# EAGLE design Adafruit_PN532_Shield_v1.3 (EAGLE 6.3)
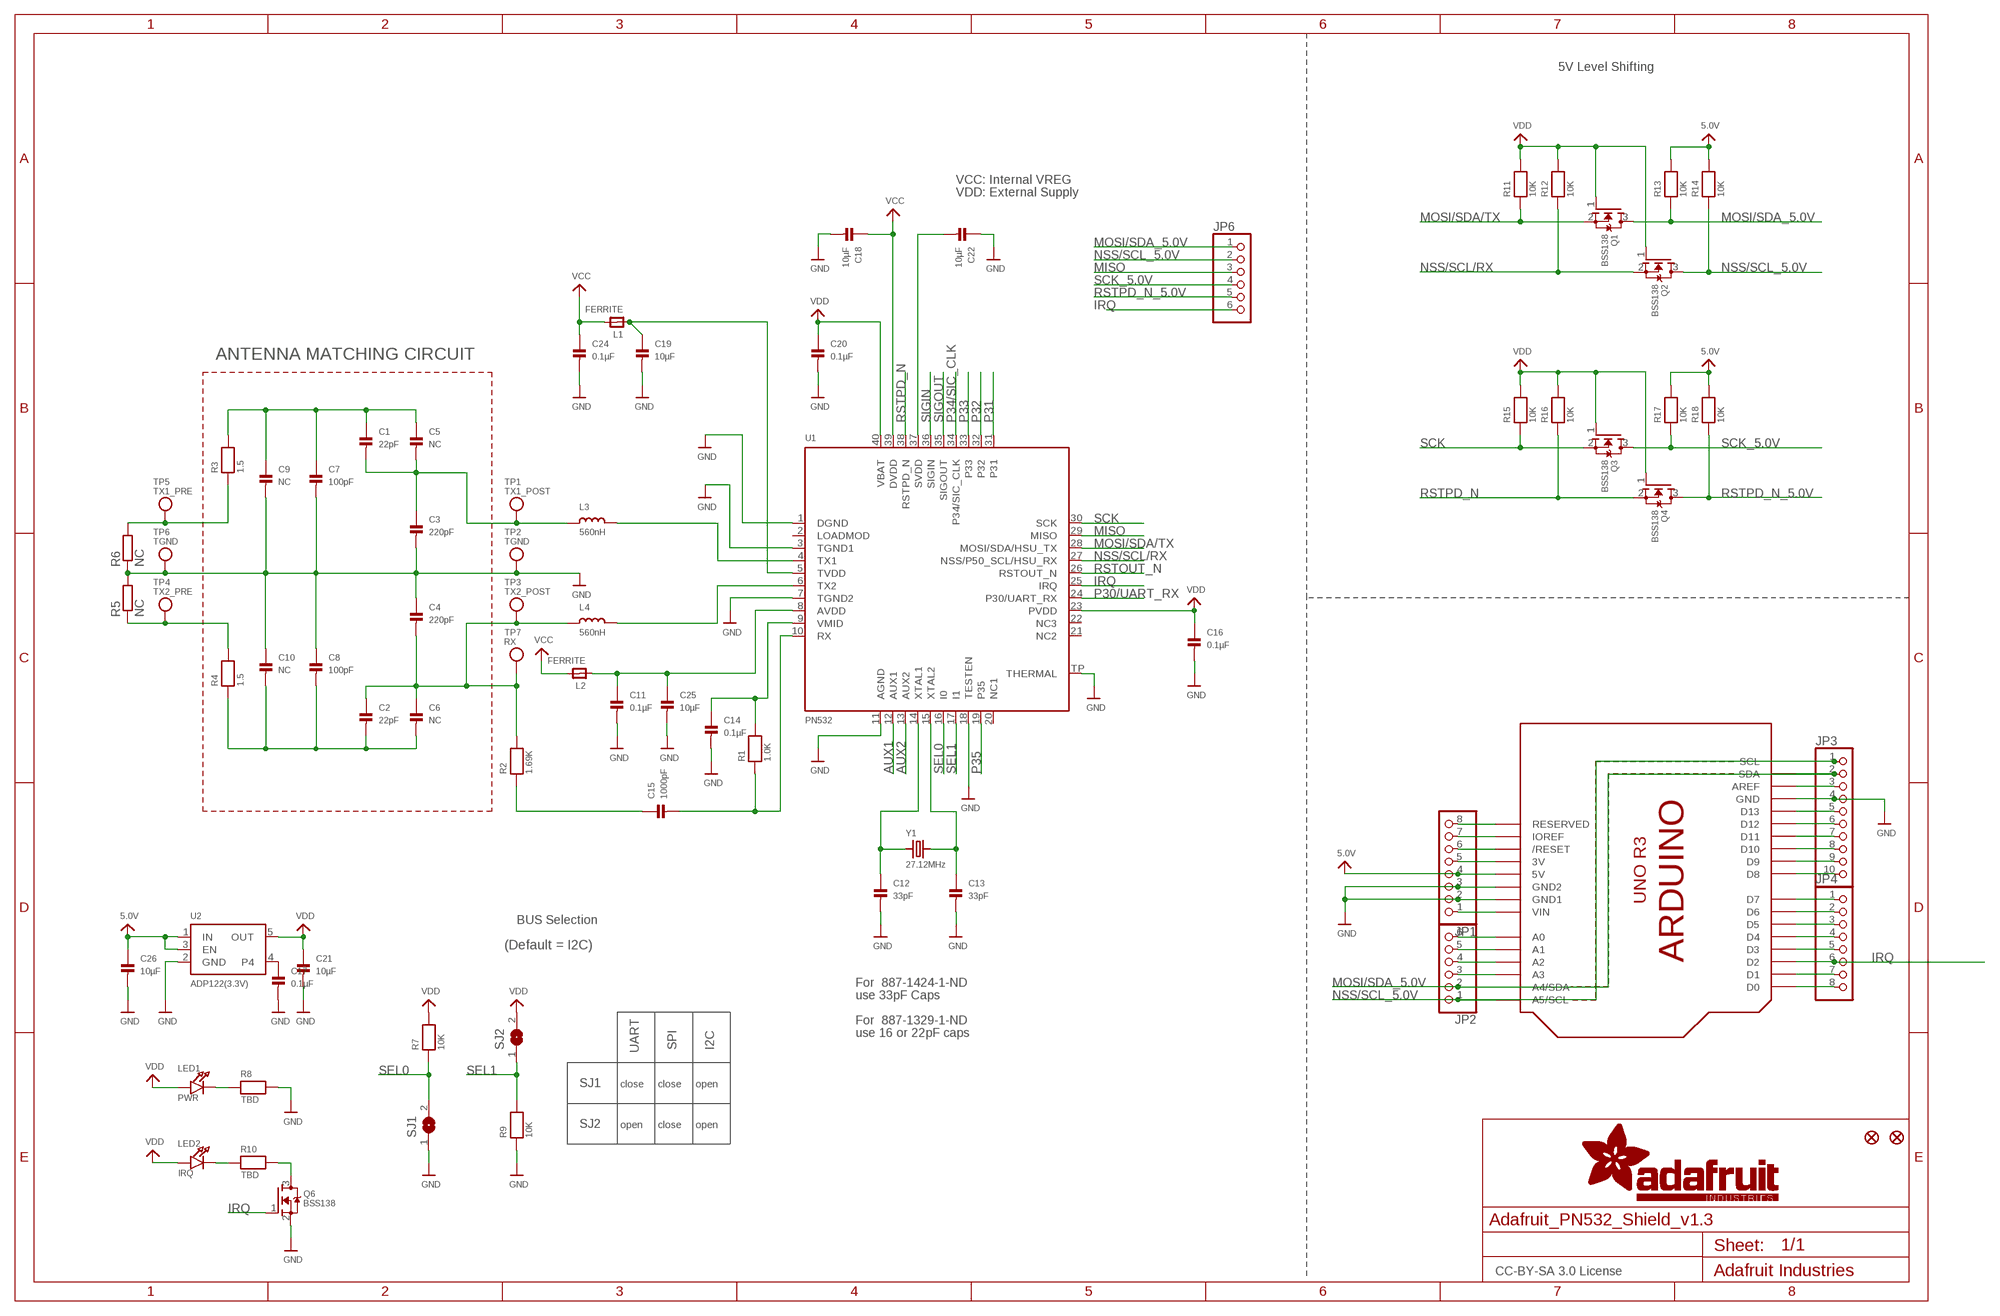
[diagram p0: schematic, sheet 1]

## Parts
C1  22pF  CAP_CERAMIC0805  [0805]
C2  22pF  CAP_CERAMIC0805  [0805]
C3  220pF  CAP_CERAMIC0805  [0805]
C4  220pF  CAP_CERAMIC0805  [0805]
C5  NC  CAP_CERAMIC0805  [0805]
C6  NC  CAP_CERAMIC0805  [0805]
C7  100pF  CAP_CERAMIC0805  [0805]
C8  100pF  CAP_CERAMIC0805  [0805]
C9  NC  CAP_CERAMIC0805  [0805]
C10  NC  CAP_CERAMIC0805  [0805]
C11  0.1µF  CAP_CERAMIC0805  [0805]
C12  33pF  CAP_CERAMIC0805  [0805]
C13  33pF  CAP_CERAMIC0805  [0805]
C14  0.1µF  CAP_CERAMIC0805  [0805]
C15  1000pF  CAP_CERAMIC0805  [0805]
C16  0.1µF  CAP_CERAMIC0805  [0805]
C17  0.1µF  CAP_CERAMIC0805  [0805]
C18  10µF  CAP_CERAMIC0805  [0805]
C19  10µF  CAP_CERAMIC0805  [0805]
C20  0.1µF  CAP_CERAMIC0805  [0805]
C21  10µF  CAP_CERAMIC0805  [0805]
C22  10µF  CAP_CERAMIC0805  [0805]
C24  0.1µF  CAP_CERAMIC0805  [0805]
C25  10µF  CAP_CERAMIC0805  [0805]
C26  10µF  CAP_CERAMIC0805  [0805]
FID1  FIDUCIAL1X2.5  [FIDUCIAL-1X2.5]
FID2  FIDUCIAL1X2.5  [FIDUCIAL-1X2.5]
JP1  HEADER-1X870MIL  [1X08_ROUND_70]
JP2  HEADER-1X670MIL  [1X06_ROUND_70]
JP3  HEADER-1X1070MIL  [1X10_ROUND70]
JP4  HEADER-1X870MIL  [1X08_ROUND_70]
JP6  PINHD-1X6B  [1X06-BIG]
L1  FERRITE  FERRITE0805  [0805]
L2  FERRITE  FERRITE0805  [0805]
L3  560nH  INDUCTOR0805  [0805]
L4  560nH  INDUCTOR0805  [0805]
LED1  PWR  LED0805  [CHIPLED_0805]
LED2  IRQ  LED0805  [CHIPLED_0805]
Q1  BSS138  MOSFET-NWIDE  [SOT23-WIDE]
Q2  BSS138  MOSFET-NWIDE  [SOT23-WIDE]
Q3  BSS138  MOSFET-NWIDE  [SOT23-WIDE]
Q4  BSS138  MOSFET-NWIDE  [SOT23-WIDE]
Q6  BSS138  MOSFET-NWIDE  [SOT23-WIDE]
R1  1.0K  RESISTOR0805  [0805]
R2  1.69K  RESISTOR0805  [0805]
R3  1.5  RESISTOR0805  [0805]
R4  1.5  RESISTOR0805  [0805]
R5  NC  R-EU_R0201  [R0201]
R6  NC  R-EU_R0201  [R0201]
R7  10K  RESISTOR0805  [0805]
R8  TBD  RESISTOR0805  [0805]
R9  10K  RESISTOR0805  [0805]
R10  TBD  RESISTOR0805  [0805]
R11  10K  RESISTOR0805  [0805]
R12  10K  RESISTOR0805  [0805]
R13  10K  RESISTOR0805  [0805]
R14  10K  RESISTOR0805  [0805]
R15  10K  RESISTOR0805  [0805]
R16  10K  RESISTOR0805  [0805]
R17  10K  RESISTOR0805  [0805]
R18  10K  RESISTOR0805  [0805]
SJ1  SOLDERJUMPERREFLOW_NOPASTE  [SOLDERJUMPER_REFLOW_NOPASTE]
SJ2  SOLDERJUMPERREFLOW_NOPASTE  [SOLDERJUMPER_REFLOW_NOPASTE]
TP1  TX1_POST  TESTPOINTPAD  [TESTPOINT_PAD_2MM]
TP2  TGND  TESTPOINTPAD  [TESTPOINT_PAD_2MM]
TP3  TX2_POST  TESTPOINTPAD  [TESTPOINT_PAD_2MM]
TP4  TX2_PRE  TESTPOINTPAD  [TESTPOINT_PAD_2MM]
TP5  TX1_PRE  TESTPOINTPAD  [TESTPOINT_PAD_2MM]
TP6  TGND  TESTPOINTPAD  [TESTPOINT_PAD_2MM]
TP7  RX  TESTPOINTPAD  [TESTPOINT_PAD_2MM]
U1  PN532  [HVQFN40-6X6]
U2  ADP122(3.3V)  VREG_SOT23-5  [SOT23-5]
U3  ARDUINOR3NODIM  [ARDUINOR3-NODIM]
Y1  27.12MHz  CRYSTAL3.2X2.5  [CRYSTAL_3.2X2.5]

## Nets
5.0V: C26.1 JP1.4 R13.2 R14.2 R17.2 R18.2 U2.1(IN) U2.3(EN) U3.5V
AUX1: U1.12(AUX1)
AUX2: U1.13(AUX2)
GND: C3.2 C4.1 C7.2 C8.1 C9.2 C10.1 C11.2 C12.2 C13.2 C14.2 C16.2 C17.2 C18.2 C19.2 C20.2 C21.2 C22.1 C24.2 C25.2 C26.2 JP1.2 JP1.3 JP3.4 Q6.2(S) R5.2 R6.1 R8.2 R9.1 SJ1.1 TP2.P$1 TP6.P$1 U1.1(DGND) U1.3(TGND1) U1.7(TGND2) U1.11(AGND) U1.18(TESTEN) U1.TP(THERMAL) U2.2(GND) U3.GND U3.GND1 U3.GND2
IRQ: JP4.6 JP6.6 Q6.1(G) U1.25(IRQ) U3.D2
MISO: JP6.3 U1.29(MISO)
MOSI/SDA/TX: Q1.2(S) R11.1 U1.28(MOSI/SDA/HSU_TX)
MOSI/SDA_5.0V: JP2.2 JP3.2 JP6.1 Q1.3(D) R13.1 U3.A4(A4/SDA) U3.SDA
N$1: L3.2 U1.4(TX1)
N$2: L4.2 U1.6(TX2)
N$3: C1.2 C3.1 C5.2 L3.1 TP1.P$1
N$4: R3.1 R6.2 TP5.P$1
N$5: R4.2 R5.1 TP4.P$1
N$6: LED1.C R8.1
N$7: C12.1 U1.14(XTAL1) Y1.1
N$8: C13.1 U1.15(XTAL2) Y1.2
N$9: C15.1 R2.1
N$10: C14.1 R1.2 U1.9(VMID)
N$11: C15.2 R1.1 U1.10(RX)
N$12: C2.1 C4.2 C6.1 L4.1 R2.2 TP3.P$1 TP7.P$1
N$13: C11.1 C25.1 L2.1 U1.8(AVDD)
N$14: C19.1 L1.1 U1.5(TVDD)
N$15: JP1.1 U3.VIN
N$16: JP1.5 U3.3V
N$17: JP1.6 U3.RESET(/RESET)
N$18: JP1.7 U3.IOREF
N$19: JP1.8 U3.RESERVED
N$20: JP2.3 U3.A3
N$21: JP2.4 U3.A2
N$22: JP2.5 U3.A1
N$23: JP2.6 U3.A0
N$24: JP3.3 U3.AREF
N$25: JP3.5 U3.D13
N$26: JP3.6 U3.D12
N$27: JP3.7 U3.D11
N$28: JP3.8 U3.D10
N$29: JP3.9 U3.D9
N$30: JP3.10 U3.D8
N$31: JP4.1 U3.D7
N$32: JP4.2 U3.D6
N$33: JP4.3 U3.D5
N$34: JP4.4 U3.D4
N$35: JP4.5 U3.D3
N$36: LED2.C R10.1
N$37: JP4.7 U3.D1
N$38: JP4.8 U3.D0
N$53: Q6.3(D) R10.2
N$54: C17.1 U2.4
N$55: C22.2 U1.37(SVDD)
NSS/SCL/RX: Q2.2(S) R12.1 U1.27(NSS/P50_SCL/HSU_RX)
NSS/SCL_5.0V: JP2.1 JP3.1 JP6.2 Q2.3(D) R14.1 U3.A5(A5/SCL) U3.SCL
P30/UART_RX: U1.24(P30/UART_RX)
P31: U1.31
P32: U1.32
P33: U1.33
P34/SIC_CLK: U1.34(P34/SIC_CLK)
P35: U1.19(P35)
RSTOUT_N: U1.26(RSTOUT_N)
RSTPD_N: Q4.2(S) R16.1 U1.38(RSTPD_N)
RSTPD_N_5.0V: JP6.5 Q4.3(D) R18.1
SCK: Q3.2(S) R15.1 U1.30(SCK)
SCK_5.0V: JP6.4 Q3.3(D) R17.1
SEL0: R7.1 SJ1.2 U1.16(I0)
SEL1: R9.2 SJ2.1 U1.17(I1)
SIGIN: U1.36(SIGIN)
SIGOUT: U1.35(SIGOUT)
TX1_ANTENNA: C1.1 C5.1 C7.1 C9.1 R3.2
TX2_ANTENNA: C2.2 C6.2 C8.2 C10.2 R4.1
VCC: C18.1 C24.1 L1.2 L2.2 U1.39(DVDD)
VDD: C16.1 C20.1 C21.1 LED1.A LED2.A Q1.1(G) Q2.1(G) Q3.1(G) Q4.1(G) R7.2 R11.2 R12.2 R15.2 R16.2 SJ2.2 U1.23(PVDD) U1.40(VBAT) U2.5(OUT)
Unconnected: U1.2(LOADMOD) U1.20(NC1) U1.21(NC2) U1.22(NC3)

## Notes on the sheet
- 5V Level Shifting
- VCC: Internal VREG
- VDD: External Supply
- ANTENNA MATCHING CIRCUIT
- BUS Selection
- (Default = I2C)
- For  887-1424-1-ND
- use 33pF Caps
- For  887-1329-1-ND
- use 16 or 22pF caps
- UART | SPI | I2C
- SJ1 | close | close | open
- SJ2 | open | close | open
- CC-BY-SA 3.0 License

## Library data of the parts
C1-C22 C24-C26 = microbuilder:CAP_CERAMIC: Ceramic Capacitors 0402 - 0402 Surface Mount Capacitors 16pF 50V 5% [Digikey: 445-4899-2-ND] 18pF 50V 5% [Digikey: 490-1281-2-ND] 22pF 50V 5% [Digikey: 490-1283-2-ND] 68pF 50V 5% [Digikey: 490-1289-2-ND] 0.1uF 10V 10% [Digikey: 490-1318-2-ND] 1.0uF 6.3V 10% [Digikey: 490-1320-2-ND] 0603 - 0603 Surface Mount Capacitors 16 pF 50V 5% [Digikey: 445-5051-2-ND] 22 pF 50V [Digikey: PCC220ACVTR-ND] 33 pF 50V 5% [Digikey: 490-1415-1-ND] 56pF 50V 5% [Digikey: 490-1421-1-ND] 220pF 50V 5% [Digikey: 445-1285-1-ND] 680 pF 50V 2200 pF 50V 5% C0G [Digikey: 445-1297-1-ND] 5600 pF 100V 5% X7R [Digikey: 478-3711-1-ND] 0.1 µF 25V 10% [Digikey: PCC2277TR-ND] 0.22 µF 16V 10% X7R [Digikey: 445-1318-1-ND] 1.0 µF 25V 10% [Digikey: 445-5146-2-ND] 0603 - RF Specific 3pF 250V +/-0.1pF RF [Digikey: 712-1347-1-ND] 18 pF 250V 5% [Digikey: 478-3505-1-ND or 712-1322-1-ND] 56 pF 250V 5% C0G RF [Digikey: 490-4867-1-ND] 68 pF 250V RF [Digikey: 490-4868-1-ND] 0805 - 0805 Surface Mount Capacitors 220 pF 250V 2% RF Ceramic Capacitor [Digikey: 712-1398-1-ND] 1000 pF 50V 2% NP0 Ceramic Capacitor [Digikey: 478-3760-1-ND] 0.1 µF 25V 10% Ceramic Capacitor [Digikey: PCC1828TR-ND] 1.0 µF 16V 10% Ceramic Capacitor[Digikey: 490-1691-2-ND] 10.0 µF 10V 10% Ceramic Capacitor[Digikey: 709-1228-1-ND] 10.0 uF 16V 10% Ceramic Capacitor [Digikey: 478-5165-2-ND] 47 uF 6.3V 20% Ceramic Capacitor [Digikey: 587-1779-1-ND or 399-5506-1-ND] 1206 - 1206 Surface Mount Capacitors 47uF 10V 20% Ceramic Capacitor [Digikey: 490-5528-1-ND or 399-5508-1-ND or 445-6010-1-ND] 100uF 6.3V -20%, +80% Y5V Ceramic Capacitor (Digikey: 490-4512-1-ND, Mouser: 81-GRM31CF50J107ZE1L)
FID1 FID2 = microbuilder:FIDUCIAL: Fiducial Alignment Points Various fiducial points for machine vision alignment.; BOM: EXCLUDE
JP1 JP4 = microbuilder:HEADER-1X8: PIN HEADER
JP2 = microbuilder:HEADER-1X6: PIN HEADER
JP3 = microbuilder:HEADER-1X10: PIN HEADER
JP6 = adafruit:PINHD-1X6: PIN HEADER
L1 L2 = microbuilder:FERRITE: Ferrite Bead 0603 MMZ1608B121C - 120 Ohm @ 100MHz, 600mA, 0.15 Ohm DC Resistance - Digikey: 445-2164-1-ND BK1608HW121-T - 120 Ohm, 600mA Ferrite Chip - Digikey: 587-1876-2-ND 0805 HZ0805B272R-10 - 2.7K Ohm @ 100MHz, 200mA, 0.8 Ohm DC Resistance - Digikey: 240-2504-1-ND (see also Murata BLM21BD272SN1L) MMZ2012Y152B - 1.5K Ohm @ 100MHz, 500mA, 0.4 Ohm DC Resistance - Digikey: 445-1560-1-ND - Mainly for high frequency (80-400MHz) MMZ2012R102A - 1K Ohm @ 100MHz, 500mA, 0.3 Ohm DC Resistance - Digikey: 445-1555-2-ND - More general purpose (10-200MHz)
L3 L4 = microbuilder:INDUCTOR: Inductors 0603: 10nH Ceramic Inductor - microwire antenna/RF (Digikey: 712-1434-2-ND) 0805: 560nH Ceramic Inductor - RF (Digikey: 553-1047-1-ND) 270nH Ceramic Inductor - Q = 40@250MHz, +-5%, 1 Ohm DC Resistance (Digikey: 535-10506-2-ND) 1007 (2518 Metric) SMT: 10µH 10% 250mOhm 820mA 1007 Inductor (Digikey: 587-2189-1-ND) 22µH 10% 500mOhm 580mA 1007 Inductor (Digikey: 587-2190-1-ND) 47µH 10% 950mOhm 420mA 1007 Inductor (Digikey: 587-2191-1-ND) 47µH 5% 100mOhm 1A 1008 Inductor (Digikey: 732-1816-1-ND) 5.0x5.0mm (Taiyo Yuden NR5040 Series) 6.8µH 20% 2.3A 64mOhm Inductor (Digikey: 587-2374-2-ND) 5.0x5.0mm (TDK VLC5045 Series) 4.7µH 20% 3.3A 34mOhm Inductor (Digikey: 445-6526-1-ND) 6.8µH 20% 2.7A 46mOhm Inductor (Digikey: 445-6527-1-ND) 6.0x6.0mm (TDK VLC6045 Series) 4.7µH 20% 3.8A 27mOhm Inductor (Digikey: 445-6538-2-ND) 6.8µH 20% 3A 41mOhm Inductor (Digikey: 445-6540-1-ND) 6.2µH 30% 2.2A 45mOhm Inductor (Digikey: SRR5028-6R2YCT-ND) - Not TDK VLC6045 but footprint should match 6.0x6.0mm (TDK SLF6045 Series) 6.8uH 30% 2A 33mOhm Inductor (Digikey: 445-4572-1-ND, Mouser: 810-SLF645T6R8N2R0PF) 6.0x6.0mm (Sumida CDRH5D28 Series) 6.2uH 30% 1.8A 45mOhm Inductor (Digikey: 308-1542-1-ND) Taiyo Yuden NR3015T2R2M - 2.2uH 20% 1.5A (Digikey: 587-1648-2-ND, Mouser: 963-NR3015T2R2M) - Used with TI TPS62172
LED1 LED2 = microbuilder:LED: LED 0603 - 0603 Surface Mount Package 2mA: Green LED - Low Power (3.9mcd, 2ma, 1.7Vf) - Digikey: 475-2709-2-ND Orange LED - Low Power (9.8mcd, 2ma, 1.8Vf) - Digikey: 475-1194-2-ND Red LED - Low Power (5mcd, 2ma, 1.8Vf) - Digikey: 475-1195-2-ND Yellow LED - Low Power (7mcd, 2ma, 1.8Vf) - Digikey: 475-1196-2-ND 5mA: Blue LED - Low Power (17mcd, 5ma, 2.9Vf) - Digikey: LNJ937W8CRACT-ND 0805 - 0805 Surface Mount Package 2mA: Red LED (8.8mcd, 2mA, 1.8Vf, Clear) - Low Power [Digikey: 475-2510-1-ND] Green LED (5mcd, 2mA, 1.8Vf, Clear) - Low Power [Digikey: 475-2730-1-ND] Yellow LED (11.3mcd, 2mA, 1.8Vf, Clear) - Low Power [Digikey: 475-2555-1-ND] 20mA: Red LED (104mcd, 20mA, Diffused) - LS R976 [Digikey: 475-1278-6-ND] Red LED (12mcd, 20mA, 2.0Vf, Clear) - APT2012EC [Digikey: 754-1128-1-ND] Green LED (15mcd, 20mA, 2.2Vf, Clear) - APT2012GC [Digikey: 754-1131-1-ND] Orange LED (160mcd, 20mA, 2.1Vf, Clear) - APT2012SECK [Digikey: 754-1130-1-ND] 1206 - 1206 Surface Mount Package Green LED (26mcd, 20mA, Diffused) - LG N971 [Digikey: 475-1407-6-ND] Red LED (15mcd, 20mA, Diffused) - LH N974 [Digikey: 475-1416-6-ND] Cree - Cree High-Power Surface Mount LEDs XPEBWT-L1-0000-00D50 - White 111lm 350mA 2.9Vf 6200K 110° XTEAWT-00-0000-00000LEE3 - White 114lm 350mA 2.85Vf 5000K 115°
Q1-Q4 Q6 = microbuilder:MOSFET-N: N-Channel Mosfet LEGEND VDS: Voltage Drain-Source ID: Drain Current RDS(ON): Drain-Source On-State Resistance VGS(TH): Gate-Source Threshold Voltage CISS: Drain-Source Input Capacitance SOT-23 Name VDS ID RDS(ON) VGS(TH) CISS Order Number 2N7002E 60V 260mA 2.5 Ohm 2.5V @ 250uA 26.7pF @ 25V 2N7002ET1GOSTR-ND BSH103 30V 850mA 400 mOhm 400mV @ 1mA 83pF @ 24V BSH103,235-ND BSS138 60V 320mA 1.6 Ohm 1.5V @ 250uA 50pF @ 10V Mouser: 771-BSS138PW115 DMN2075U-7 20V 4.2A 38 mOhm 1V @ 250 uA 594.3pF @ 10V DMN2075U-7DICT-ND * BSS138 good choice for I2C level-shifting
R1-R4 R7-R18 = microbuilder:RESISTOR: Resistors 0402 - 0402 Surface Mount Package 22 Ohm 1% 1/16W [Digikey: 311-22.0LRTR-ND] 33 Ohm 5% 1/16W 1.0K 5% 1/16W 1.5K 5% 1/16W 2.0K 1% 1/16W 10.0K 1% 1/16W [Digikey: 311-10.0KLRTR-ND] 10.0K 5% 1/16W [Digikey: RMCF0402JT10K0TR-ND] 12.1K 1% 1/16W [Digikey: 311-22.0LRTR-ND] 100.0K 5% 1/16W 0603 - 0603 Surface Mount Package 0 Ohm 1/10 Watt 1% Resistor 15 Ohm 1/10 Watt 1% Resistor 33 Ohm 1/10 Watt 1% Resistor 49.9 Ohm 1/10 Watt 1% Resistor 100 Ohm 1/10 Watt 1% Resistor 150 Ohm 1/10 Watt 1% Resistor 240 Ohm 1/10 Watt 1% Resistor 390 Ohm 1/10 Watt 1% Resistor 560 Ohm 1/10 Watt 1% Resistor 680 Ohm 1/10 Watt 1% Resistor 750 Ohm 1/10 Watt 1% Resistor 1.0K Ohm 1/10 Watt 1% Resistor 1.5K Ohm 1/10 Watt 1% Resistor 2.0K Ohm 1/10 Watt 1% Resistor 2.2K Ohm 1/10 Watt 1% Resistor 3.3K Ohm 1/10 Watt 1% Resistor 4.7K Ohm 1/10 Watt 1% Resistor 10.0K Ohm 1/10 Watt 1% Resistor 12.0K Ohm 1/10 Watt 1% Resistor 12.1K Ohm 1/10 Watt 1% Resistor 20.0K Ohm 1/10 Watt 1% Resistor 33.0K Ohm 1/10 Watt 1% Resistor 100.0K Ohm 1/10 Watt 1% Resistor 0805 - 0805 Surface Mount Package 0 Ohm 1/8 Watt 1% Resistor 33 Ohm 1/8 Watt 1% Resistor 100 Ohm 1/8 Watt 1% Resistor 150 Ohm 1/8 Watt 1% Resistor 200 Ohm 1/8 Watt 1% Resistor 240 Ohm 1/8 Watt 1% Resistor 330 Ohm 1/8 Watt 1% Resistor 390 Ohm 1/8 Watt 1% Resistor 470 Ohm 1/8 Watt 1% Resistor 1.0K Ohm 1/8 Watt 1% Resistor 1.5K Ohm 1/8 Watt 1% Resistor 2.0K Ohm 1/8 Watt 1% Resistor 4.7K Ohm 1/8 Watt 1% Resistor 5.1K Ohm 1/8 Watt 1% Resistor 5.6K Ohm 1/8 Watt 1% Resistor 10.0K Ohm 1/8 Watt 1% Resistor 22.0K Ohm 1/8 Watt 1% Resistor 33.0K Ohm 1/8 Watt 1% Resistor 100K Ohm 1/8 Watt 1% Resistor 1206 - 1206 Surface Mount Package 2012 - 2010 Surface Mount Package 0.11 Ohm 1/2 Watt 1% Resistor - Digikey: RHM.11UCT-ND
R5 R6 = rcl:R-EU_: RESISTOR, European symbol
SJ1 SJ2 = microbuilder:SOLDERJUMPER: SMD Solder JUMPER Solder the two pads together to create a connection, or remove the solder to break it. REFLOW - Use this footprint for solder paste and reflow ovens. WAVE - Use this footprint for hand-soldering (larger pads). CLOSED - Has a trace between the two pads to ensure it is closed by default. The trace needs to be cut to disable the jumper, and can be closed again by creating a solder bridge between the two pads.
TP1-TP7 = microbuilder:TESTPOINT: Test Point Various test points for characterisation and PCB testing TESTPOINT_SMT - Compact Surface Mount Test Point [Digikey: 5016KTR-ND]
U1 = microbuilder:PN532: PN532 - Near Field Communication (NFC) controller Highly integrated transceiver module for contactless communication at 13.56 MHz (14443A/MIFARE, FeliCa, I4443B)
U2 = microbuilder:VREG_SOT23-5: SOT23-5 Fixed Voltage Regulators Part Current Out V Out V In V Dropout θJA (°C/W) TJ (°C) Digikey Part No. ADP121 150mA 3.3V 3.4-5.5V 0.09V @ 150mA -- -- ADP121-AUJZ33R7CT-ND ADP121 150mA 3.0V 3.1-5.5V 0.09V @ 150mA -- -- ADP121-AUJZ30R7CT-ND ADP122 300mA 3.3V 3.4-5.5V 0.085V @ 300mA -- -- ADP122AUJZ-3.3-R7CT-ND ADP1712 300mA 3.3V 3.5-5.5V 0.17V @ 300mA -- -- ADP1712AUJZ-3.3-R7TR-ND AP7311 (Low Cost) 150mA 3.3V 3.5-6V 0.15V @ 150mA -- -- AP7311-33WG-7DICT-ND LD39015M18R 150mA 1.8V 1.9V-5.5V 0.08V @ 100mA -- -- 497-6977-1-ND LP2985A-33DBVR 150mA 3.3V 3.3-16V 0.28V @ 150mA 206 150 296-18479-1-ND MCP1824T-3302E/OT 300mA 3.3V 3.5V-6V 0.2V @ 300mA -- -- MCP1824T-3302E/OTCT-ND MIC5205-2.5YM5 TR 150mA 2.5V 2.7-16V 0.165V @ 150mA -- -- 576-1257-2-ND MIC5205-3.0YM5 TR 150mA 3.0V 3.2V-16V 0.165V @ 150mA -- -- 576-1258-2-ND MIC5205-3.3YM5 TR 150mA 3.3V 3.5V-16V 0.165V @ 150mA -- -- 576-1259-2-ND TPS780330220 150mA 3.3V+2.2V 3.6-5.5V 250mV Max -- -- 296-23332-1-ND TDA3663/N1,135 100mA 3.3V 3.5-45V 0.18V @ 50mA -- -- 568-5343-1-ND Max operating temp can be calculated using θJA, TJ (max junction temperature), and power in watts. Set the "Maximum Ambient Temperature" until it reaches TJ ("Max Junction Temperature"), which is the absolute limit for safe use of the regulator: Heat Sink Temperature Calculator <http://www.daycounter.com/Calculators/Heat-Sink-Temperature-Calculator.phtml> For example, With 12V source into a 3.3V LP2985 and a 30mA load, we are dissipating (12V-3.3V) * 0.03A = 0.261W. With a θJA of 206 °C/W, a TJ of 150°C, and 261mW we can safely use the chip without a heat sink up to 75°C (=147.1°C Junction Temperature).
U3 = microbuilder:ARDUINOR3: This is a new object for the new Arduino R3 - with extra pins that you may want to use (such as IOref, and duplicated A4/A5
Y1 = microbuilder:CRYSTAL: Crystals HC49UP - Surface Mount Crystal 4.0MHz 18pF +/-30ppm Surface Mount Crystal [Digikey: 535-9857-1-ND] 12.0 MHz Surface Mount Crystal [Digikey: 535-9869-6-ND] 25.0 MHz Surface Mount Crystal [Digikey: 535-9078-1-ND] 2.5 x 2.0mm - MEMs SMT Crystal 16.0 MHz 10pF 20ppm 2.5 x 2.0mm Crystal [Digikey -40-85°C: 535-10923-1-ND] 3.2 x 2.5mm - MEMs SMT Crystal 12.0 MHz 8pF 15ppm 3.2 x 2.5mm Crystal [Digikey: -10-70°C: 644-1047-1-ND -40-125°C: 644-1128-1-ND] 16.0 MHz 8pF 15ppm 3.2 x 2.5mm Crystal [Digikey: -10-70°C: 644-1049-1-ND -40-125°C: 644-1129-2-ND] 16.0 MHz 10pF 10ppm 3.2 x 2.5mm Crystal [Digikey: 644-1100-1-ND] 27.12 MHz 18pF 30ppm 3.2 x 2.5mm Crystal [Digikey: 887-1424-1-ND] 27.12MHz 10pF 10ppm 3.2 x 2.5mm Crystal [Digikey: 887-1329-1-ND] 4.9 x 1.8mm - MEMs SMT Crystal 32.768 KHz 12.5pF 20ppm 4.9 x 1.8mm Crystal [Digikey: SE2415CT-ND] 8.0 x 3.8mm - Surface Mount Crystal 32.768kHz 12.5pF 20ppm -40°C-85°C [Digikey: 535-9166-2-ND] Cylinder 32.768KHz Cylinder Crystal (2x6mm body) [Ex. Digikey: 300-8341-2-ND]

## Board
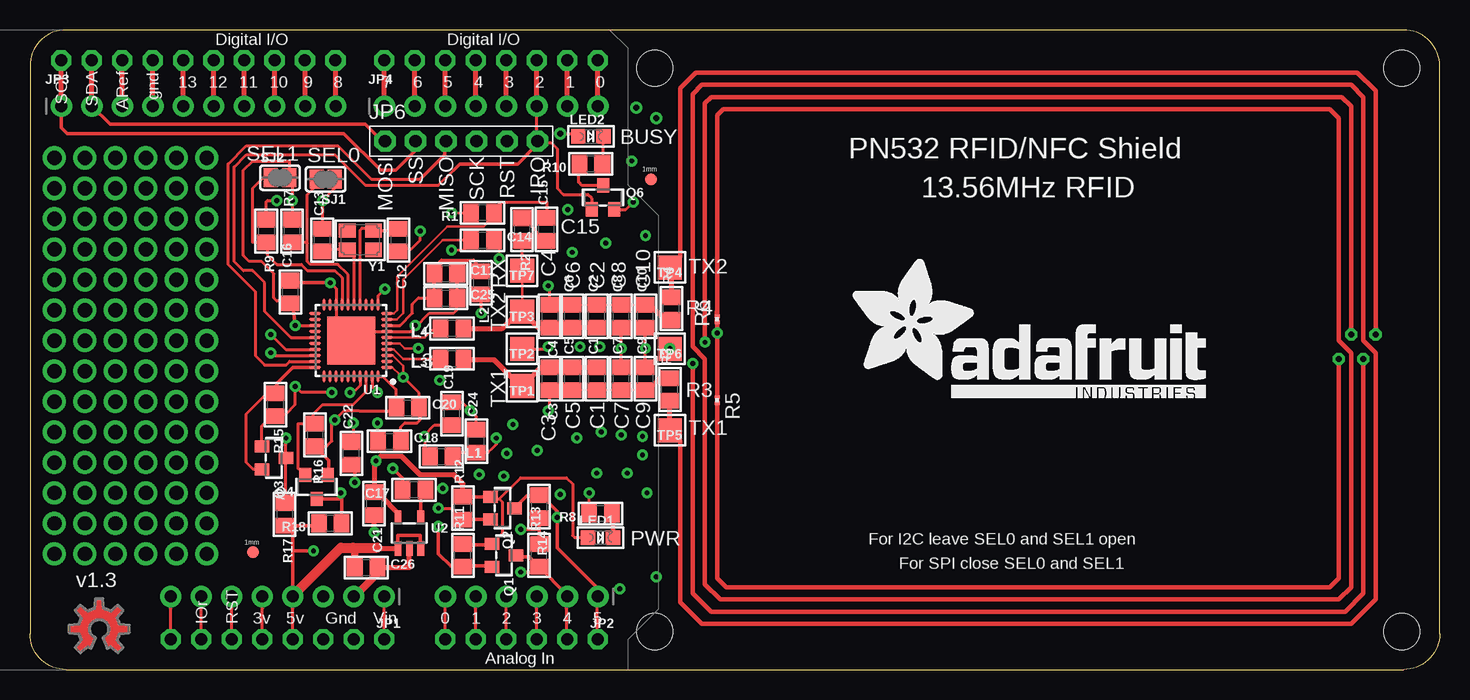
[diagram p1: board, top side]
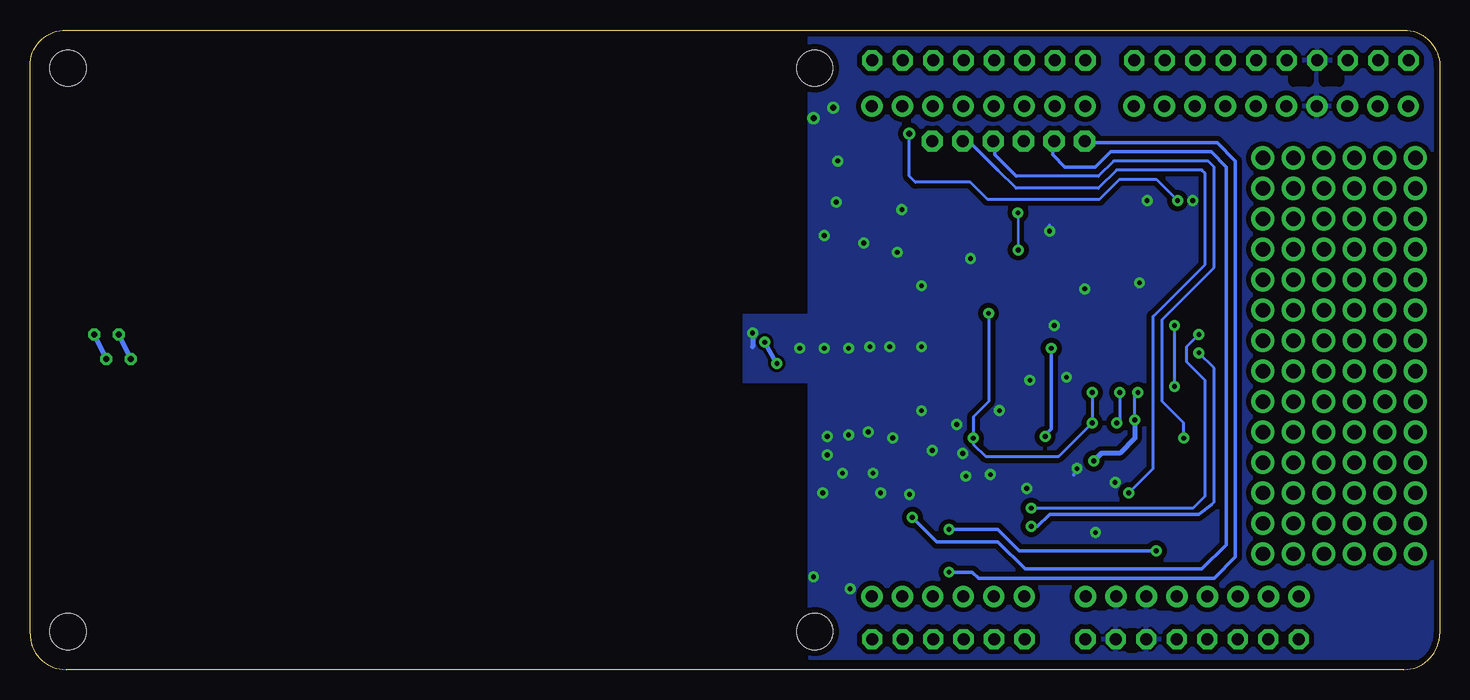
[diagram p2: board, bottom side, seen from below]

Size 117.47 x 53.34 mm. Coordinates in mm from the lower left corner, seen from the top.
Outline: 3,0 114.46,0 arc90 117.47,3 117.47,50.34 arc90 114.46,53.34 3,53.34 arc90 0,50.34 0,3 arc90 3,0
Copper layers (1+16): Top 0.035mm / dielectric 1.5mm / Bottom 0.035mm
Design rules "default": minimum track width 8mil, minimum drill 0.4mm, track to track 8mil, track to pad 8mil, pad to pad 8mil, via to via 8mil, smd to smd 8mil, copper to edge 20mil, drill to drill 8mil, minimum pad ring 8mil, minimum via ring 10mil, stop-mask expansion 3mil, vias tented up to drill 20mil, thermal gap 8mil
Holes 3 mm at 52.07,50.16 114.3,50.16 114.3,3.17 52.07,3.17
tRestrict: area 29.4,24.9 to 30.1,25; area 28.8,27.2 to 29.1,27.7; area 26.5,25.1 to 27,25.4; area 24.5,27.2 to 24.8,27.7; area 26.3,29.5 to 27.3,29.7
bRestrict: area 8.4,49 to 9.7,50; area 10.9,49 to 12.2,50; area 25.4,1.8 to 25.9,3; area 25.4,5.3 to 25.9,6.6; area 22.9,5.3 to 23.4,6.6; area 27.9,5.3 to 28.4,6.6; area 58.5,7.9 to 107.8,45.7

### Footprints (pad centres in the part's own frame; a part is rotated, then mirrored left to right if it is on the bottom)
0805 = smd 1.3 x 1.5: 1 -0.95,0; 2 0.95,0
FIDUCIAL-1X2.5 = smd 1 x 1: 1 0,0
1X08_ROUND_70 = drill 1 pad 1.778: 1 -8.89,0; 2 -6.35,0; 3 -3.81,0; 4 -1.27,0; 5 1.27,0; 6 3.81,0; 7 6.35,0; 8 8.89,0
1X06_ROUND_70 = drill 1 pad 1.778: 1 -6.35,0; 2 -3.81,0; 3 -1.27,0; 4 1.27,0; 5 3.81,0; 6 6.35,0
1X10_ROUND70 = drill 1 pad 1.778: 1 -11.43,0; 2 -8.89,0; 3 -6.35,0; 4 -3.81,0; 5 -1.27,0; 6 1.27,0; 7 3.81,0; 8 6.35,0; 9 8.89,0; 10 11.43,0
1X06-BIG = drill 1.016 pad 1.778 octagon: 1 -6.35,0; 2 -3.81,0; 3 -1.27,0; 4 1.27,0; 5 3.81,0; 6 6.35,0
CHIPLED_0805 = smd 1.2 x 1.2: A 0,-1.05; C 0,1.05
SOT23-WIDE = smd 1 x 1.2: 1 -0.95,-1; 2 0.95,-1; 3 0,1
R0201 = smd 0.28 x 0.43: 1 -0.255,0; 2 0.255,0
SOLDERJUMPER_REFLOW_NOPASTE = smd 1.168 x 1.6: 1 -0.762,0; 2 0.762,0
TESTPOINT_PAD_2MM = smd 2 x 2: P$1 0,0
HVQFN40-6X6 = smd 1 x 0.25: 1 -2.99,2.25; 2 -2.99,1.75; 3 -2.99,1.25; 4 -2.99,0.75; 5 -2.99,0.25; 6 -2.99,-0.25; 7 -2.99,-0.75; 8 -2.99,-1.25; 9 -2.99,-1.75; 10 -2.99,-2.25; 21 2.99,-2.25; 22 2.99,-1.75; 23 2.99,-1.25; 24 2.99,-0.75; 25 2.99,-0.25; 26 2.99,0.25; 27 2.99,0.75; 28 2.99,1.25; 29 2.99,1.75; 30 2.99,2.25 | smd 0.25 x 1: 11 -2.25,-2.99; 12 -1.75,-2.99; 13 -1.25,-2.99; 14 -0.75,-2.99; 15 -0.25,-2.99; 16 0.25,-2.99; 17 0.75,-2.99; 18 1.25,-2.99; 19 1.75,-2.99; 20 2.25,-2.99; 31 2.25,2.99; 32 1.75,2.99; 33 1.25,2.99; 34 0.75,2.99; 35 0.25,2.99; 36 -0.25,2.99; 37 -0.75,2.99; 38 -1.25,2.99; 39 -1.75,2.99; 40 -2.25,2.99 | smd 4 x 4: TP 0,0
SOT23-5 = smd 0.55 x 1.2: 1 -0.95,-1.3; 2 0,-1.3; 3 0.95,-1.3; 4 0.95,1.3; 5 -0.95,1.3
ARDUINOR3-NODIM = drill 1 pad 1.676 octagon: 3V 35.56,2.54; 5V 38.1,2.54; A0 50.8,2.54; A1 53.34,2.54; A2 55.88,2.54; A3 58.42,2.54; A4 60.96,2.54; A5 63.5,2.54; AREF 23.876,50.8; D0 63.5,50.8; D1 60.96,50.8; D2 58.42,50.8; D3 55.88,50.8; D4 53.34,50.8; D5 50.8,50.8; D6 48.26,50.8; D7 45.72,50.8; D8 41.656,50.8; D9 39.116,50.8; D10 36.576,50.8; D11 34.036,50.8; D12 31.496,50.8; D13 28.956,50.8; GND 26.416,50.8; GND1 43.18,2.54; GND2 40.64,2.54; IOREF 30.48,2.54; RESERVED 27.94,2.54; RESET 33.02,2.54; SCL 18.796,50.8; SDA 21.336,50.8; VIN 45.72,2.54
CRYSTAL_3.2X2.5 = smd 1.4 x 1.2: 1 -1.1,-0.8; 2 1.1,0.8; GND1 -1.1,0.8; GND2 1.1,-0.8

### Placement (x,y rotation side)
C1  47.23,24.26 90 top
C2  47.23,29.46 90 top
C3  43.3,24.26 270 top
C4  43.3,29.46 270 top
C5  45.2,24.26 90 top
C6  45.2,29.46 90 top
C7  49.26,24.26 90 top
C8  49.26,29.46 90 top
C9  51.29,24.26 90 top
C10  51.29,29.46 90 top
C11  34.66,33.02 0 top
C12  30.7,35.82 270 top
C13  24.35,35.82 90 top
C14  37.71,35.81 0 top
C15  43.04,36.72 90 top
C16  21.7,31.5 90 top
C17  32,14.99 180 top
C18  29.96,19.05 0 top
C19  35.16,21.34 90 top
C20  31.48,21.84 0 top
C21  28.67,13.84 270 top
C22  26.78,18.03 90 top
C24  37.19,19.05 90 top
C25  34.66,30.99 0 top
C26  28.01,8.52 0 top
FID1  18.6,9.78 180 top
FID2  51.74,40.89 180 top
JP1  20.62,6.1 180 top
JP2  40.97,6.1 180 top
JP3  14.05,46.99 0 top
JP4  38.43,46.99 0 top
JP6  35.94,44.07 0 top
L1  34.27,17.78 0 top
L2  37.58,32.26 270 top
L3  35.16,25.91 180 top
L4  35.16,28.45 180 top
LED1  47.54,11.01 270 top
LED2  46.74,44.45 270 top
Q1  39.5,9.53 270 top
Q2  39.37,13.46 270 top
Q3  20.32,17.65 270 top
Q4  23.88,15.24 180 top
Q6  47.75,39.37 0 top
R1  37.71,38.09 180 top
R2  41.01,36.7 270 top
R3  53.32,23.36 90 top
R4  53.44,30.1 90 top
R5  57.26,22.48 270 top
R6  57.26,29.21 90 top
R7  21.84,36.58 90 top
R8  47.54,13.01 180 top
R9  19.68,36.58 270 top
R10  46.74,42.16 180 top
R11  36.07,9.53 90 top
R12  36.07,13.46 90 top
R13  42.42,9.53 90 top
R14  42.42,13.59 270 top
R15  20.45,22.1 270 top
R16  23.75,19.56 270 top
R17  21.21,12.95 270 top
R18  25.02,12.19 180 top
SJ1  24.64,40.89 180 top
SJ2  20.83,41.02 0 top
TP1  41.01,23.64 180 top
TP2  41.01,26.74 180 top
TP3  41.01,29.85 180 top
TP4  53.32,33.53 180 top
TP5  53.32,19.96 180 top
TP6  53.31,26.74 180 top
TP7  41.01,33.27 180 top
U1  26.75,27.45 180 top
U2  31.61,11.39 0 top
U3  -16.2,0 0 top
U$3  [ADAFRUIT_TEXT_30MM]  68.34,22.69 0 top
U$50  [OSHWLOGO_TOP_0.2]  5.76,3.39 0 top
Y1  27.53,35.81 180 top

### Tracks (layer width: path | path; a pad name or v marks a point on that pad's centre or on a via)
5.0V  (via drill 0.4)
  Top 0.254: U3.5V 21.9,5.08 JP1.4
  Top 0.305: JP1.4 21.89,9.91 | 21.89,9.91 21.89,11.38 21.27,12 R17.2 23.69,12 23.88,12.19 R18.2 | U2.1 30.66,11.18 32.51,11.18 32.51,10.16 32.56,10.16 U2.3 | 32.51,9.91 32.56,9.95 U2.3 | 42.42,12.7 R14.2 R13.2 42.42,11.68 v40.89,11.68 | U2.3 32.56,9.91 | 21.89,9.91 v23.62,9.91
  Top 0.406: U2.1 29.02,10.1 28.96,10.16
  Top 0.61: C26.1 27.06,10.02 26.92,10.16
  Top 0.813: JP1.4 21.84,6.1 25.91,10.16 26.92,10.16 28.96,10.16
  Bottom 0.305: v40.89,11.68 36.83,11.68 35.05,9.91 v23.62,9.91
GND  (via drill 0.4, 0.5)
  Top 0.203: U1.1 30.21,25.2 30.81,24.6 | v39.1,34.29 39.1,35.52 C14.2 | U1.3 30.22,26.2 31.1,25.32 v31.1,24.38
  Top 0.254: C8.1 v49.26,26.8 C7.2 | C10.1 v51.29,26.8 v51.29,26.79 C9.2 | v53.33,26.8 53.37,26.8 TP6.P$1 | C4.1 43.3,31.88 v43.18,32 | C3.2 43.3,21.71 v43.18,21.59 | R8.2 v46.59,14.73 | TP2.P$1 43,26.74 v43.18,26.92 | 32.13,28.57 31.76,28.2 U1.7 27.5,28.2 U1.TP 25.5,28.7 U1.18 25.5,31.78 v25.02,32.26 | 32.13,28.57 33.27,29.72 35.31,29.72 35.56,29.97 35.56,30.94 C25.2 C11.2 | v32.12,28.7 32.12,28.59 32.13,28.57 | 30.81,24.6 30.88,24.6 v31.1,24.38 32.43,23.05 C20.2 32.51,21.76 32.51,20.83 32.26,20.57 31.24,20.57 30.91,20.24 C18.2 | C19.2 36,22.29 v36.69,21.6 37.19,21.09 C24.2 | v27.05,15.62 27.04,15.51 | U1.11 29,31.17 v29.58,31.75 | v32.51,36.58 32.51,35.81 31.75,35.05 30.89,35.05 C12.2 | C13.2 24.38,37.56 v24.38,39.12 25.4,40.13 SJ1.1 | R9.1 19.68,37.97 19.68,38.99 19.81,39.12 v20.57,39.12 | Q6.2 49.66,38.37 v50.28,38.99
  Top 0.305: 26.78,17.02 26.67,17.02 | C22.1 26.78,17.02 | v27.05,15.62 27.05,17.02 26.78,17.02 | C16.2 21.59,32.33 21.59,32.26 v25.02,32.26 | C17.2 31.05,15.94 v30.23,16.76
  Top 0.356: R5.2 v57.26,28.07 R6.1
  Top 0.406: R6.1 57.26,29.84 | U3.GND 10.24,50.8 JP3.4 | C26.2 31.61,8.51 U2.2 | v28.69,11.43 28.7,11.18 28.67,11.21 C21.2
  Top 0.61: JP1.2 27.05,6.1 28.96,8.01 C26.2
  Top 0.813: 26.92,6.35 26.98,6.3 JP1.2
  Bottom 0.254: v43.18,32 43.18,32.26 | v43.18,21.59 43.18,21.84 | v43.18,26.92 43.43,26.92 | v25.02,32.26 25.15,31.88 | v32.51,36.58 32.51,37.08
  Bottom 0.305: v30.23,16.76 30.48,16.26
  Bottom 0.406: v57.26,28.07 57.26,26.92
  other vias: 51.42,14.73 47.99,35.56 49.26,19.56 47.61,19.81 51.04,19.43 52.18,45.97 51.29,36.2 45.2,34.8 47.48,26.92 45.83,26.92 45.58,19.31 51.04,17.91 49.77,16.38 47.23,16.38 44.82,38.35 34.15,24.13 42.28,18.29 39.48,16.13 40.24,20.45 34.4,15.11 37.44,16.26 39.74,18.03 49.13,6.73 52.18,7.75 50.15,42.42 50.53,46.86 44.18,14.61
  pour Bottom (isolate 0.406): 52.44,52.83 0.37,52.83 0.37,0.98 52.44,0.98
  pour Bottom (isolate 0.254): 52.07,29.46 58.17,29.46 58.17,24.13 52.07,24.13
IRQ
  Top 0.254: U1.25 21.73,27.7 19.56,29.87 19.56,32.26 18.54,33.27 17.78,33.27 17.02,34.04 17.02,41.91 18.03,42.93 25.4,42.93 27.94,40.39 34.04,40.39 35.31,41.66 | JP4.6 42.24,44.12 JP6.6 42.42,43.94 43.43,43.94 43.94,43.43 43.94,40.13 44.45,39.62 46.48,39.62 46.8,39.3 Q6.1
  Top 0.305: 35.31,41.66 35.81,42.16 40.64,42.16 42.16,43.69 42.16,44.2 JP6.6
  Top 0.406: U3.D2 42.24,50.8 JP4.6
MISO
  Top 0.254: U1.29 21.64,25.7 21.34,25.4 19.56,25.4 18.8,26.16 18.8,31.5 16.51,33.78 16.51,42.16 18.03,43.69 25.65,43.69 28.45,40.89 32.51,40.89
  Top 0.305: JP6.3 34.54,43.94 34.54,42.93 32.51,40.89
MOSI/SDA/TX  (via drill 0.4)
  Top 0.254: U1.28 20.28,26.2 v20.07,26.42
  Top 0.305: 38.56,8.64 38.61,8.64 | 38.56,8.64 Q1.2 | 36.13,8.64 R11.1 | 36.13,8.64 38.56,8.64 | 36.13,8.64 35.05,8.64 34.04,9.65 v34.04,11.94
  Bottom 0.254: 19.05,13.72 18.8,13.97 18.8,25.15 v20.07,26.42
  Bottom 0.305: v34.04,11.94 33.53,11.94 32.51,12.95 20.07,12.95 19.05,13.72
MOSI/SDA_5.0V  (via drill 0.4)
  Top 0.254: 44.7,5.08 44.7,5.46 | 44.7,5.08 44.7,2.6 U3.A4 | 44.7,5.08 JP2.2 44.7,5.16
  Top 0.305: JP3.2 6.68,45.47 27.94,45.47 29.46,43.94 29.72,43.94 JP6.1 | JP2.2 44.7,6.1 44.7,6.29 R13.1 | Q1.3 40.62,9.4 41.59,9.4 R13.1 | R13.1 42.42,8.13 v40.89,8.13
  Top 0.406: U3.SDA 5.16,50.8 JP3.2
  Bottom 0.305: 5.08,47.07 5.08,47.24 | JP3.2 5.08,47.07 | 5.08,47.07 5.08,46.99 | v40.89,8.13 38.94,8.13 38.43,7.62 18.8,7.62 17.02,9.4 17.02,42.42 18.54,43.94 29.72,43.94 JP6.1
N$1
  Top 0.203: U1.4 30.31,26.7 31.1,25.91 L3.2
N$2
  Top 0.203: U1.6 32.89,27.7 33.64,28.45 L4.2
N$3
  Top 0.203: C1.2 C5.2 | L3.1 36.18,25.84 | 41.56,24.17 41.01,24.17 41.01,24.26
  Top 0.406: TP1.P$1 41.56,23.68 41.56,24.17 42.66,25.27 43.71,25.27 C3.1 C1.2 | 36.18,25.84 38.66,25.84 40.12,24.38 40.88,24.38 41.01,24.26
N$4
  Top 0.356: TP5.P$1 54.21,19.07 54.21,5.6 55.99,3.81 110.09,3.81 112.13,5.84 112.13,26.42 111.11,27.43 111.11,47.75 110.09,48.77 55.99,48.77 55.23,48.01 55.23,26.92 56.25,25.91 56.25,7.11 57.52,5.84 109.08,5.84 110.09,6.86 110.09,26.42 109.08,27.43 109.08,45.97 108.32,46.74 57.77,46.74 57.26,46.23 R6.2
  Top 0.406: TP5.P$1 R3.1
N$5  (via drill 0.4, 0.5)
  Top 0.356: v112.13,27.94 112.13,48.26 110.6,49.78 55.48,49.78 54.21,48.51 54.21,34.42 TP4.P$1 | v111.11,25.91 111.11,6.35 109.59,4.83 56.75,4.83 55.23,6.35 v55.23,25.53 | v56.25,27.3 56.25,47.24 56.75,47.75 109.33,47.75 110.09,46.99 v110.09,27.94 | v109.08,25.91 109.08,7.62 108.32,6.86 58.02,6.86 57.26,7.62 R5.1 57.26,22.86
  Top 0.406: R4.2 53.44,33.4 TP4.P$1
  Bottom 0.406: v111.11,25.91 v112.13,27.94 | v55.23,25.53 v56.25,27.3 | v110.09,27.94 v109.08,25.91
N$6
  Top 0.406: R8.1 48.59,12.24 LED1.C
N$7
  Top 0.203: C12.1 30.91,36.87
  Top 0.254: 30.6,36.87 C12.1 30.7,36.61 Y1.1 28.59,36.83 27.69,36.83 27.5,36.64 U1.14
N$8
  Top 0.254: C13.1 24.75,35.01 Y1.2 27,34.7 U1.15
N$9
  Top 0.254: C15.1 43.05,35.75 43.05,35.69 41.15,37.59
  Top 0.305: 41.15,37.59 41.09,37.65 R2.1
N$10  (via drill 0.4)
  Top 0.203: U1.9 30.58,29.2 31.1,29.72 31.1,32.51 34.4,35.81 C14.1 | C14.1 36.69,35.81 | v35.15,38.09 R1.2 | v35.12,34.99 36.19,34.99 C14.1
  Bottom 0.203: v35.12,34.99 35.12,37.82 v35.15,38.09
N$11
  Top 0.203: U1.10 30.32,29.7 30.59,29.97 30.59,32.77 34.77,36.95 37.82,36.95 38.72,37.85 R1.1
  Top 0.254: 38.85,38.6 39.24,38.99 43.05,38.99 43.05,37.65 | 43.05,37.65 43.05,37.59 | 43.05,37.65 C15.2
  Top 0.305: R1.1 38.85,38.6
N$12
  Top 0.203: L4.1 36.18,28.51 | TP3.P$1 TP7.P$1
  Top 0.254: TP7.P$1 R2.2
  Top 0.406: C2.1 C6.1 C4.2 43.24,28.45 42.42,28.45 TP3.P$1 40.5,29.34 40.24,29.34 39.35,28.45 L4.1
N$13
  Top 0.254: U1.8 30.84,28.7 31.86,29.72 31.86,30.48 32.37,30.99 C25.1 C11.1 33.81,33.69 34.27,34.16 36.95,34.16 37.58,33.53 L2.1
N$14  (via drill 0.4)
  Top 0.203: U1.5 30.82,27.2 31.23,26.8 v32.37,26.8
  Top 0.254: C19.1 33.71,20.39 32.88,19.56 v32.88,19.43 32.88,18.23 L1.1
  Bottom 0.305: v32.37,26.8 32.37,20.07 32.88,19.56 v32.88,19.43
N$15
  Top 0.254: U3.VIN 29.52,5.08 JP1.1
N$16
  Top 0.254: U3.3V 19.36,5.08 JP1.5
N$17
  Top 0.254: U3.RESET 16.82,5.08 JP1.6
N$18
  Top 0.254: U3.IOREF 14.28,5.08 JP1.7
N$19
  Top 0.254: U3.RESERVED 11.74,5.08 JP1.8
N$20
  Top 0.254: U3.A3 42.22,5.06 JP2.3
N$21
  Top 0.254: U3.A2 39.68,5.06 JP2.4
N$22
  Top 0.254: U3.A1 37.14,5.06 JP2.5
N$23
  Top 0.254: U3.A0 34.6,5.06 JP2.6
N$24
  Top 0.406: U3.AREF 7.7,50.8 JP3.3
N$25
  Top 0.406: U3.D13 12.78,50.8 JP3.5
N$26
  Top 0.406: U3.D12 15.32,50.8 JP3.6
N$27
  Top 0.406: U3.D11 17.86,50.8 JP3.7
N$28
  Top 0.406: U3.D10 20.4,50.8 JP3.8
N$29
  Top 0.406: U3.D9 22.94,50.8 JP3.9
N$30
  Top 0.406: U3.D8 25.48,50.8 JP3.10
N$31
  Top 0.406: U3.D7 29.54,50.8 JP4.1
N$32
  Top 0.406: U3.D6 32.08,50.8 JP4.2
N$33
  Top 0.406: U3.D5 34.62,50.8 JP4.3
N$34
  Top 0.406: U3.D4 37.16,50.8 JP4.4
N$35
  Top 0.406: U3.D3 39.7,50.8 JP4.5
N$36
  Top 0.254: LED2.C 47.79,42.52 R10.1
N$37
  Top 0.406: U3.D1 44.78,50.8 JP4.7
N$38
  Top 0.406: U3.D0 47.32,50.8 JP4.8
N$39  (via drill 1.2 pad 1.93)
  other vias: 2.03,42.67
N$40  (via drill 1.2 pad 1.93)
  other vias: 2.03,40.13
N$41  (via drill 1.2 pad 1.93)
  other vias: 2.03,37.59
N$42  (via drill 1.2 pad 1.93)
  other vias: 2.03,35.05
N$43  (via drill 1.2 pad 1.93)
  other vias: 2.03,32.51
N$44  (via drill 1.2 pad 1.93)
  other vias: 2.03,29.97
N$45  (via drill 1.2 pad 1.93)
  other vias: 2.03,27.43
N$46  (via drill 1.2 pad 1.93)
  other vias: 2.03,24.89
N$47  (via drill 1.2 pad 1.93)
  other vias: 2.03,22.35
N$48  (via drill 1.2 pad 1.93)
  other vias: 2.03,19.81
N$49  (via drill 1.2 pad 1.93)
  other vias: 2.03,17.27
N$50  (via drill 1.2 pad 1.93)
  other vias: 2.03,14.73
N$51  (via drill 1.2 pad 1.93)
  other vias: 2.03,12.19
N$52  (via drill 1.2 pad 1.93)
  other vias: 2.03,9.65
N$53
  Top 0.254: R10.2 45.72,42.1 45.72,40.64 45.99,40.37 Q6.3
N$54
  Top 0.305: C17.1 33.02,14.99 32.56,14.53 U2.4
N$55  (via drill 0.4)
  Top 0.254: U1.37 27.5,23.69 26.92,23.11 v26.67,23.11 | v26.92,20.57 26.92,19.13 C22.2
  Bottom 0.254: v26.67,23.11 26.67,20.83 v26.92,20.57
N$62  (via drill 1.2 pad 1.93)
  other vias: 4.57,9.65
N$63  (via drill 1.2 pad 1.93)
  other vias: 7.11,9.65
N$64  (via drill 1.2 pad 1.93)
  other vias: 7.11,12.19
N$65  (via drill 1.2 pad 1.93)
  other vias: 4.57,14.73
N$66  (via drill 1.2 pad 1.93)
  other vias: 4.57,17.27
N$67  (via drill 1.2 pad 1.93)
  other vias: 7.11,17.27
N$68  (via drill 1.2 pad 1.93)
  other vias: 7.11,14.73
N$69  (via drill 1.2 pad 1.93)
  other vias: 4.57,12.19
N$70  (via drill 1.2 pad 1.93)
  other vias: 4.57,19.81
N$71  (via drill 1.2 pad 1.93)
  other vias: 7.11,19.81
N$72  (via drill 1.2 pad 1.93)
  other vias: 7.11,22.35
N$73  (via drill 1.2 pad 1.93)
  other vias: 4.57,22.35
N$74  (via drill 1.2 pad 1.93)
  other vias: 4.57,24.89
N$75  (via drill 1.2 pad 1.93)
  other vias: 7.11,24.89
N$76  (via drill 1.2 pad 1.93)
  other vias: 7.11,27.43
N$77  (via drill 1.2 pad 1.93)
  other vias: 4.57,27.43
N$78  (via drill 1.2 pad 1.93)
  other vias: 4.57,29.97
N$79  (via drill 1.2 pad 1.93)
  other vias: 7.11,29.97
N$80  (via drill 1.2 pad 1.93)
  other vias: 7.11,32.51
N$81  (via drill 1.2 pad 1.93)
  other vias: 4.57,32.51
N$82  (via drill 1.2 pad 1.93)
  other vias: 4.57,35.05
N$83  (via drill 1.2 pad 1.93)
  other vias: 7.11,35.05
N$84  (via drill 1.2 pad 1.93)
  other vias: 7.11,37.59
N$85  (via drill 1.2 pad 1.93)
  other vias: 4.57,37.59
N$86  (via drill 1.2 pad 1.93)
  other vias: 4.57,40.13
N$87  (via drill 1.2 pad 1.93)
  other vias: 4.57,42.67
N$88  (via drill 1.2 pad 1.93)
  other vias: 7.11,42.67
N$89  (via drill 1.2 pad 1.93)
  other vias: 7.11,40.13
N$90  (via drill 1.2 pad 1.93)
  other vias: 9.65,40.13
N$91  (via drill 1.2 pad 1.93)
  other vias: 9.65,42.67
N$92  (via drill 1.2 pad 1.93)
  other vias: 9.65,37.59
N$93  (via drill 1.2 pad 1.93)
  other vias: 9.65,35.05
N$94  (via drill 1.2 pad 1.93)
  other vias: 9.65,32.51
N$95  (via drill 1.2 pad 1.93)
  other vias: 9.65,29.97
N$96  (via drill 1.2 pad 1.93)
  other vias: 9.65,27.43
N$97  (via drill 1.2 pad 1.93)
  other vias: 9.65,24.89
N$98  (via drill 1.2 pad 1.93)
  other vias: 9.65,19.81
N$99  (via drill 1.2 pad 1.93)
  other vias: 9.65,17.27
N$100  (via drill 1.2 pad 1.93)
  other vias: 9.65,12.19
N$101  (via drill 1.2 pad 1.93)
  other vias: 9.65,9.65
N$102  (via drill 1.2 pad 1.93)
  other vias: 9.65,14.73
N$103  (via drill 1.2 pad 1.93)
  other vias: 9.65,22.35
N$104  (via drill 1.2 pad 1.93)
  other vias: 12.19,42.67
N$105  (via drill 1.2 pad 1.93)
  other vias: 14.73,42.67
N$106  (via drill 1.2 pad 1.93)
  other vias: 14.73,40.13
N$107  (via drill 1.2 pad 1.93)
  other vias: 12.19,40.13
N$108  (via drill 1.2 pad 1.93)
  other vias: 12.19,37.59
N$109  (via drill 1.2 pad 1.93)
  other vias: 14.73,37.59
N$110  (via drill 1.2 pad 1.93)
  other vias: 14.73,35.05
N$111  (via drill 1.2 pad 1.93)
  other vias: 12.19,35.05
N$112  (via drill 1.2 pad 1.93)
  other vias: 12.19,32.51
N$113  (via drill 1.2 pad 1.93)
  other vias: 14.73,32.51
N$114  (via drill 1.2 pad 1.93)
  other vias: 14.73,29.97
N$115  (via drill 1.2 pad 1.93)
  other vias: 12.19,29.97
N$116  (via drill 1.2 pad 1.93)
  other vias: 12.19,27.43
N$117  (via drill 1.2 pad 1.93)
  other vias: 14.73,27.43
N$118  (via drill 1.2 pad 1.93)
  other vias: 14.73,24.89
N$119  (via drill 1.2 pad 1.93)
  other vias: 12.19,24.89
N$120  (via drill 1.2 pad 1.93)
  other vias: 12.19,22.35
N$121  (via drill 1.2 pad 1.93)
  other vias: 14.73,22.35
N$122  (via drill 1.2 pad 1.93)
  other vias: 14.73,19.81
N$123  (via drill 1.2 pad 1.93)
  other vias: 12.19,19.81
N$124  (via drill 1.2 pad 1.93)
  other vias: 12.19,17.27
N$125  (via drill 1.2 pad 1.93)
  other vias: 14.73,17.27
N$126  (via drill 1.2 pad 1.93)
  other vias: 14.73,14.73
N$127  (via drill 1.2 pad 1.93)
  other vias: 12.19,14.73
N$128  (via drill 1.2 pad 1.93)
  other vias: 12.19,12.19
N$129  (via drill 1.2 pad 1.93)
  other vias: 14.73,12.19
N$130  (via drill 1.2 pad 1.93)
  other vias: 14.73,9.65
N$131  (via drill 1.2 pad 1.93)
  other vias: 12.19,9.65
NSS/SCL/RX  (via drill 0.4)
  Top 0.254: U1.27 21.31,26.7 v20.07,27.94 | R12.1 35.12,13.46 v34.04,13.46
  Top 0.305: Q2.2 38.37,12.46 38.35,12.45 38.29,12.51 R12.1
  Bottom 0.254: v20.07,27.94 21.08,26.92 21.08,25.65 19.56,24.13 19.56,14.48 20.57,13.46 v34.04,13.46
NSS/SCL_5.0V  (via drill 0.4)
  Top 0.254: U3.A5 47.24,2.6 47.24,5.59 47.32,5.51 JP2.1
  Top 0.305: JP2.1 47.24,6.1 47.24,6.86 43.94,10.16 v43.94,12.7 43.94,13.21 42.67,14.48 42.42,14.48 | Q2.3 41.39,14.48 42.42,14.48 | 42.42,14.48 R14.1 | JP6.2 32.26,44.2 32.26,43.43 30.48,41.66 29.21,41.66 26.16,44.7 3.12,44.7 2.62,45.21 JP3.1
  Top 0.406: U3.SCL 2.62,50.8 JP3.1
  Bottom 0.305: JP3.1 2.54,46.99 | v43.94,12.7 41.91,10.67 36.83,10.67 34.54,8.38 19.81,8.38 17.78,10.41 17.78,41.91 19.05,43.18 27.43,43.18 28.7,41.91 31.24,41.91 32.26,42.93 32.26,43.94 JP6.2
RSTPD_N
  Top 0.254: U1.38 28,23.17 26.92,22.1 24.38,22.1 23.62,21.34 23.62,20.57 23.68,20.57 R16.1 22.35,20.51 22.35,16.76 22.88,16.24 Q4.2
RSTPD_N_5.0V  (via drill 0.4)
  Top 0.254: 25.97,14.22 25.97,14.67 v25.91,14.73
  Top 0.305: Q4.3 23.88,14.22 25.97,14.22 R18.1
  Bottom 0.254: v25.91,14.73 23.88,16.76 23.88,29.46 19.56,33.78 19.56,41.4 19.81,41.66 26.92,41.66 28.45,40.13 35.31,40.13 36.83,41.66
  Bottom 0.305: JP6.5 39.62,43.94 39.12,43.94 36.83,41.66
SCK
  Top 0.254: Q3.2 18.6,16.7 18.03,17.27 18.03,21.34 20.07,23.37 20.39,23.05 R15.1
  Top 0.305: U1.30 21.9,25.2 20.57,23.88 20.57,23.11 20.51,23.05 R15.1
SCK_5.0V  (via drill 0.4)
  Top 0.254: R17.1 21.15,13.9 21.08,13.97 21.32,14.21 Q3.3 21.32,19.29 v21.34,19.3
  Bottom 0.254: v21.34,19.3 21.34,20.57 23.11,22.35 23.11,29.21 18.8,33.53 18.8,41.91 19.3,42.42 27.18,42.42 28.45,41.15 35.31,41.15
  Bottom 0.305: JP6.4 37.08,43.94 37.08,42.93 35.31,41.15
SEL0
  Top 0.254: 23.11,35.56 23.11,39.62 23.88,40.39 SJ1.2 | R7.1 23.05,35.63 23.11,35.56 | 23.11,35.56 23.11,34.04 23.37,33.78 25.65,33.78 26.5,32.94 U1.16
SEL1
  Top 0.254: 19.81,35.75 19.81,35.81 | 19.81,35.75 R9.2 18.54,35.63 18.54,40.13 19.94,41.53 SJ2.1 | 19.81,35.75 19.81,34.54 20.57,33.78 22.61,33.78 23.11,33.27 25.4,33.27 26,32.67 U1.17
TX1_ANTENNA
  Top 0.203: C9.1 C7.1 C1.1 C5.1
  Top 0.406: C9.1 51.34,23.71 51.93,23.71 52.54,24.32 R3.2
TX2_ANTENNA
  Top 0.203: C10.2 C8.2 C2.2 C6.2
  Top 0.406: C10.2 51.7,30.41 52.79,29.32 53.28,29.32 R4.1
VCC  (via drill 0.4)
  Top 0.254: U1.39 28.5,23.57 v28.96,23.11 | v28.96,20.57 28.96,19.1 C18.1 | v38.86,19.3 38.86,18.8 38.61,18.54 38.17,18.1 C24.1 35.55,18.1 L1.2 | L2.2 37.58,29.73 v37.59,29.72
  Bottom 0.254: v28.96,23.11 v28.96,20.57 31.75,17.78 37.85,17.78 38.86,18.8 v38.86,19.3 38.86,21.08 37.59,22.35 v37.59,29.72
VDD  (via drill 0.4, 0.5)
  Top 0.254: U1.23 22.35,28.7 v22.1,28.7 | Q1.1 39.37,11.35 39.37,13.97 39.12,14.22 | Q2.1 38.56,14.22 39.12,14.22 | Q3.1 19.32,20.34 20.32,21.34 20.45,21.21 R15.2 20.51,21.15 20.57,21.08 20.83,21.34 21.34,21.34 22.1,22.1 v22.1,23.62 22.61,23.11 v25.15,23.11 | SJ2.2 21.59,41.66 21.84,41.4 v21.84,39.12 R7.2 | 21.84,30.73 20.57,30.73 20.32,30.99 20.32,33.02 19.3,34.04 18.29,34.04 17.78,34.54 17.78,41.66 18.54,42.42 21.59,42.42 SJ2.2 | SJ2.2 21.59,41.4 | LED1.A 45.38,11.01 45.21,11.18 45.21,15.49 44.7,16 40.89,16 39.12,14.22 | v44.2,44.7 45.43,44.7 LED2.A | R16.2 24.7,18.61 25.15,19.05 25.15,20.57 v25.4,20.83 26.16,21.59 27.43,21.59 30.28,21.59 C20.1 30.48,21.89 30.48,23.37 29.39,24.46 U1.40
  Top 0.305: R12.2 36.07,14.48 36.13,14.41 Q2.1 | Q1.1 38.44,10.41 36.13,10.41 R11.2 | R15.2 20.89,21.15 | Q4.1 24.89,16.31 24.89,17.46 R16.2 | 21.84,30.69 21.84,30.73 | 21.84,30.69 C16.1 | v22.1,28.7 21.84,30.69
  Top 0.406: U2.5 30.66,13.03 29.21,14.48 28.96,14.48 28.93,14.45 C21.1 28.7,14.82 28.7,17.27 v28.83,17.4 29.21,17.78 30.99,17.78 32.51,16.26 35.31,16.26 36.07,15.49 R12.2
  Bottom 0.254: v22.1,23.62 v22.1,28.7 | v44.2,44.7 44.2,41.15 43.69,40.64 39.12,40.64 37.7,39.23 28.34,39.23 26.67,40.89 23.62,40.89 v21.84,39.12 | v25.4,20.83 25.4,22.86 v25.15,23.11
  Bottom 0.406: v25.4,20.83 25.4,19.3 26.67,18.03 28.19,18.03 v28.83,17.4

### Text on the board
tPlace: BUSY | MOSI | SS | MISO | SCK | RST | IRQ | PN532 RFID/NFC Shield | SEL1 | SEL0 | 13.56MHz RFID | C15 | RX | C4 | TX2 | C6 | C2 | C8 | C10 | TX2 | R4 | L4 | L3 | TX1 | R3 | C5 | C1 | C7 | C9 | TX1 | C3 | PWR | For I2C leave SEL0 and SEL1 open | For SPI close SEL0 and SEL1 | v1.3